# EasyEDA Pro project ASTROPET_DISPLAY_SOURCE.epro, board PCB4
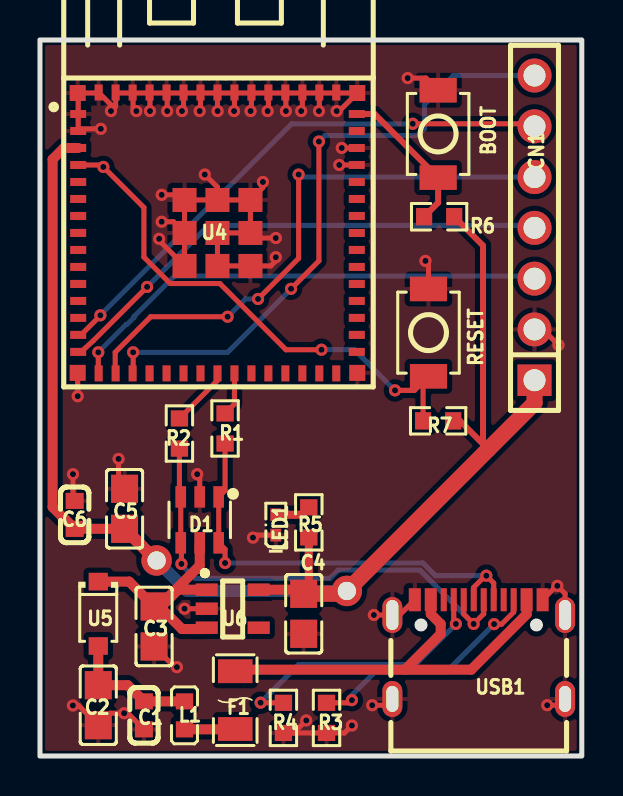
[diagram p4: board, top side]
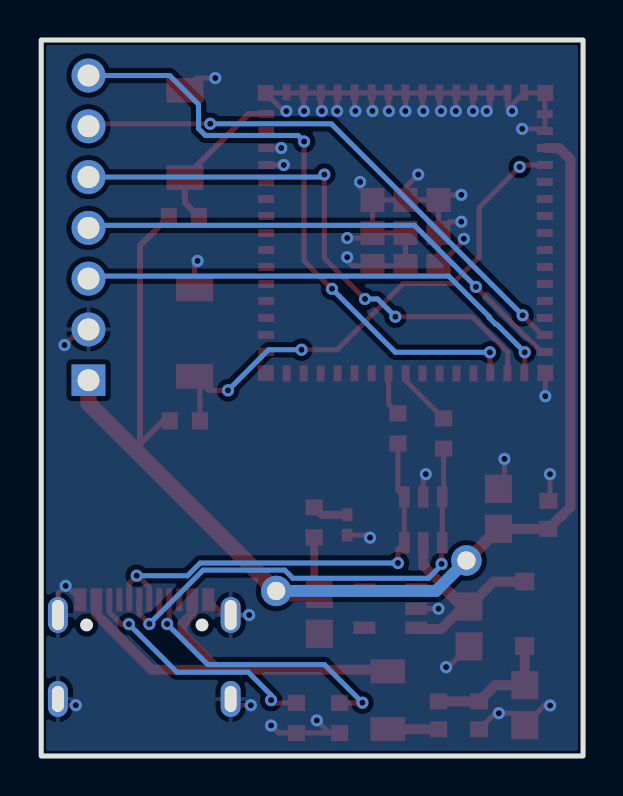
[diagram p5: board, bottom side, seen from below]

Outline 27.13 x 35.82 mm; copper layers: Top Layer, Bottom Layer. Coordinates in mm from the lower left corner of the outline.
Outline path: rectangle 0,35.82 27.13,0
Stack: Top Layer 0.035mm / Dielectric1 1.51mm FR4 er 4.5 / Bottom Layer 0.035mm

## Design rules (mm)
template: JLCPCB Capability(Two Layers Board)
spacing copperThickness1oz (default): track to track 0.102, other pairs 0.152 to 0.3
spacing copperThickness2oz: track to track 0.203, other pairs 0.152 to 0.3
track width copperThickness1oz (default): min 0.127, default 0.254, max 2.54
track width copperThickness2oz: min 0.203, default 0.254, max 2.54
differential pair differentialPair (default): width min 0.127, default 0.254, max 2.54; gap min 0.152, default 0.152
via viaSize (default): diameter min 0.5, default 0.61, max 10; hole min 0.3, default 0.305, max 6.3

## Placement (name value [footprint] x y rotation side)
BOOT  boot switch  [SW-SMD_L3.9-W3.0-P4.45]  19.94 31.12 90 top
C1  100nF  [C0603]  5.21 2.03 270 top
C2  47uF  [C0805]  2.92 2.54 270 top
C3  10uF  [C0805]  5.72 6.48 90 top
C4  22uF  [C0805]  13.21 7.11 90 top
C5  47uF  [C0805]  4.24 12.37 90 top
C6  100nF  [C0603]  1.74 12.06 90 top
CN1  screen  [HDR-TH_7P-P2.54-V-F]  24.76 26.42 90 top
D1  USBLC6-2SC6  [SOT-23-6_L2.9-W1.6-P0.95-LS2.8-BL]  8 11.81 180 top
F1  JK-NSMD075  [F1206]  9.78 2.8 270 top
L1  BLM18PG121SN1D  [L0603]  7.24 2.03 90 top
LED1  APHHS1005LSECK/J3-PF  [LED0402-RD_RED]  11.81 11.56 90 top
NOREF  -  [Pad_e86]  5.84 9.78 0 top
NOREF#2  -  [Pad_e78]  15.37 8.26 0 top
R1  22Ω  [R0603]  9.27 16.38 90 top
R2  22Ω  [R0603]  6.98 16.13 90 top
R3  5.1kΩ  [R0603]  14.35 1.91 270 top
R4  5.1kΩ  [R0603]  12.19 1.91 270 top
R5  10kΩ  [R0603]  13.46 11.69 90 top
R6  10kΩ  [R0603]  19.99 26.98 180 top
R7  10kΩ  [R0603]  19.94 16.77 180 top
RESET  reset switch  [SW-SMD_L3.9-W3.0-P4.45]  19.46 21.18 90 top
U4  2.4GHz  [BULETM-SMD_ESP32-S3-MINI-1-N8]  8.89 26.16 0 top
U5  MBR0520  [SOD-123_L2.7-W1.6-LS3.7-RD-A]  2.92 7.11 270 top
U6  AP2112K-3.3TRG1  [SOT-25-5_L2.9-W1.6-P0.95-LS2.8-BL]  9.65 7.37 270 top
USB1  TYPE C  [USB-C-SMD_TYPEC-304J-BCP16]  21.97 5.34 0 top

## Footprints (pads in the part's own frame, mm; a bottom-side part is the same pattern mirrored in y, then rotated)
BULETM-SMD_ESP32-S3-MINI-1-N8
  rect 0.8x0.4 smd: 1(-6.975,5.95) 2(-6.975,5.1) 3(-6.975,4.25) 4(-6.975,3.4) 5(-6.975,2.55) 6(-6.975,1.7) 7(-6.975,0.85) 8(-6.975,0) 9(-6.975,-0.85) 10(-6.975,-1.7) 11(-6.975,-2.55) 12(-6.975,-3.4) 13(-6.975,-4.25) 14(-6.975,-5.1) 15(-6.975,-5.95) 31(6.975,-5.95) 32(6.975,-5.1) 33(6.975,-4.25) 34(6.975,-3.4) 35(6.975,-2.55) 36(6.975,-1.7) 37(6.975,-0.85) 38(6.975,0) 39(6.975,0.85) 40(6.975,1.7) 41(6.975,2.55) 42(6.975,3.4) 43(6.975,4.25) 44(6.975,5.1) 45(6.975,5.95)
  rect 0.4x0.8 smd: 16(-5.95,-7.025) 17(-5.1,-7.025) 18(-4.25,-7.025) 19(-3.4,-7.025) 20(-2.55,-7.025) 21(-1.7,-7.025) 22(-0.85,-7.025) 23(0,-7.025) 24(0.85,-7.025) 25(1.7,-7.025) 26(2.55,-7.025) 27(3.4,-7.025) 28(4.25,-7.025) 29(5.1,-7.025) 30(5.95,-7.025) 46(5.95,7.025) 47(5.1,7.025) 48(4.25,7.025) 49(3.4,7.025) 50(2.55,7.025) 51(1.7,7.025) 52(0.85,7.025) 53(0,7.025) 54(-0.85,7.025) 55(-1.7,7.025) 56(-2.55,7.025) 57(-3.4,7.025) 58(-4.25,7.025) 59(-5.1,7.025) 60(-5.95,7.025)
  rect 0.8x0.8 smd: GND(-7,7) GND(-7,-7) GND(7,7) GND(7,-7)
  rect 1.2x1.2 smd: GND(-1.65,1.65) GND(-1.65,0) GND(-1.65,-1.65) GND(0,1.65) GND(0,0) GND(0,-1.65) GND(1.65,1.65) GND(1.65,0) GND(1.65,-1.65)
C0603
  rect 0.8x0.9 smd: 1(-0.7,0) 2(0.7,0)
C0805
  rect 1.41x1.35 smd: 1(-1,0) 2(1,0)
F1206
  rect 1.19x1.728 smd: 1(-1.445,0) 2(1.445,0)
HDR-TH_7P-P2.54-V-F
  rect 1.575x1.7 hole 1.1: 1(-7.62,0)
  round 1.7 hole 1.1: 2(-5.08,0) 3(-2.54,0) 4(0,0) 5(2.54,0) 6(5.08,0) 7(7.62,0)
L0603
  rect 0.8x0.864 smd: 1(-0.7,0) 2(0.7,0)
LED0402-RD_RED
  rect 0.636x0.54 smd: 1(-0.508,0) 2(0.508,0)
Pad_e78
  round 1.524 hole 0.914: 1(0,0)
Pad_e86
  round 1.524 hole 0.914: 1(0,0)
R0603
  rect 0.806x0.864 smd: 1(-0.753,0) 2(0.753,0)
SOD-123_L2.7-W1.6-LS3.7-RD-A
  rect 0.88x0.96 smd: 1(-1.61,0) 2(1.61,0)
SOT-23-6_L2.9-W1.6-P0.95-LS2.8-BL
  rect 0.532x1.072 smd: 1(-0.95,-1.149) 2(0,-1.149) 3(0.95,-1.149) 4(0.95,1.149) 5(0,1.149) 6(-0.95,1.149)
SOT-25-5_L2.9-W1.6-P0.95-LS2.8-BL
  rect 0.623x1.105 smd: 1(-0.95,-1.3) 2(-0.001,-1.3) 3(0.95,-1.3) 4(0.95,1.3) 5(-0.95,1.3)
SW-SMD_L3.9-W3.0-P4.45
  rect 1.23x1.86 smd: 1(-2.185,0) 2(2.185,0)
USB-C-SMD_TYPEC-304J-BCP16
  oval 1x1.8 hole 0.6x1.5: 13(-4.325,1.718) 14(4.325,1.718)
  oval 1x1.8 hole 0.6x1.3: 15(-4.325,-2.482) 16(4.325,-2.482)
  rect 0.6x1.15 smd: A1B12(-3.2,2.482) A4B9(-2.4,2.482) B1A12(3.2,2.482) B4A9(2.4,2.482)
  rect 0.3x1.15 smd: A5(-1.25,2.482) A6(-0.25,2.482) A7(0.25,2.482) A8(1.25,2.482) B5(1.75,2.482) B6(0.75,2.482) B7(-0.75,2.482) B8(-1.75,2.482)

## Nets
As in the schematic, except:
3V3: C4.2 C5.1 C6.1 CN1.1 NOREF.1 NOREF#2.1 R5.1 R6.1 R7.1 U4.3 U6.5

Pads without a net: U4 5 6 7 8 9 10 11 12 13 19 20 21 22 25 26 27 28 29 30 31 32 33 34 35 36 37 38 39 40 41 44; U6 4; USB1 A8 B8

## Via types
v1: diameter 0.61, hole 0.305, Top Layer to Bottom Layer, 63 vias

## Routing (per net, layer and track width the routed paths; a pad name or vN(x,y) marks a point on that pad's centre or on a via; arc(x,y) is an arc through that point)
3V3: length 71.3
  Top Layer w0.3: 22.19,15.61 22.45,15.34 ; 22.19,15.61 21.03,16.77 R7.1 ; 22.19,15.61 22.19,25.53 R6.1
  Top Layer w0.4: R5.1 13.46,8.51 13.59,8.38
  Top Layer w0.5: C5.1 1.74,11.37 ; 1.74,11.37 C6.1 ; 1.74,11.37 1.15,11.96 1.12,11.96 0.63,12.45 0.63,29.85 1.2,30.41 U4.3 ; C4.2 13,8.32 U6.5
  Top Layer w0.6: NOREF.1 5.82,9.78 C5.1
  Top Layer w0.8: C4.2 15.22,8.11 NOREF#2.1 24.76,17.65 CN1.1
  Bottom Layer w0.6: NOREF#2.1 7.37,8.26 NOREF.1
5V: length 13.2
  Top Layer w0.5: U6.1 6.92,8.32 6.08,7.48 5.98,7.48 7.11,6.35 8.29,6.35 U6.3 ; U5.1 4.47,8.72 C3.2 5.95,7.48 8,9.53 D1.5
GND: length 86.4
  Top Layer w0.254: U4.GND 11.16,28.44 v1(11.16,28.71) ; U4.GND U4.GND ; U4.GND U4.GND ; C3.1 6.75,4.45 v1(6.86,4.45) ; 13.14,33.16 12.31,33.16 U4.49 ; 13.14,33.16 13.99,33.16 ; 13.14,33.16 U4.48 ; 13.14,33.16 13.14,32.32 v1(13.08,32.26) ; U4.52 9.74,33.16 ; 9.74,33.16 9.74,32.28 v1(9.72,32.26) ; 9.74,33.16 10.59,33.16 ; 9.74,33.16 8.89,33.16 ; v1(11.4,32.26) 11.44,32.3 11.44,33.16 ; v1(8.25,29.08) 8.89,28.45 U4.GND ; v1(8,32.26) 8.04,32.3 8.04,33.16 ; v1(7.11,32.26) 7.19,32.34 7.19,33.16 6.35,33.16 ; v1(11.81,25.91) 10.79,25.91 U4.GND ; v1(4.83,32.26) 4.66,32.42 4.66,33.16 ; U4.53 8.89,33.16 ; 8.89,33.16 8.89,32.27 v1(8.9,32.26) ; 8.89,33.16 8.04,33.16 ; v1(18.41,33.91) 19.33,33.91 BOOT.2 ; USB1.16 25.98,2.54 v1(25.4,2.54) ; 6.35,33.16 6.37,33.14 v1(6.37,32.26) ; 6.35,33.16 6.35,33.18 U4.56 ; 6.35,33.16 5.51,33.16 ; USB1.15 17.33,2.54 v1(16.64,2.54) ; LED1.1 10.79,11.05 v1(10.67,10.92) ; v1(5.51,32.26) 5.51,33.16 5.51,33.16 ; U4.GND U4.GND U4.GND U4.GND 11.56,24.51 11.81,24.77 v1(11.81,24.95) ; U4.51 10.59,33.16 ; 10.59,33.16 11.44,33.16 ; 10.59,33.16 10.59,32.3 v1(10.55,32.26) ; U4.GND U4.GND ; U4.GND 6.98,28.07 v1(6.1,28.07) ; U4.GND U4.GND ; 13.99,33.16 U4.47 ; 13.99,33.16 13.99,32.28 v1(13.97,32.26) ; 13.99,33.16 14.84,33.16 ; v1(7.87,14.1) 8,13.97 D1.2 ; C5.2 3.94,13.67 v1(3.94,14.86) ; v1(5.97,25.87) 5.97,25.78 U4.GND U4.GND ; 8.04,33.16 7.22,33.16 U4.55 ; 8.04,33.16 U4.54 ; 5.51,33.16 4.66,33.16 ; 5.51,33.16 U4.57 ; USB1.A1B12 18.01,7.05 USB1.13 v1(16.72,7.05) ; R4.2 12.71,1.15 ; 12.71,1.15 v1(13.33,1.78) ; 12.71,1.15 R3.2 15.25,1.15 v1(15.62,1.53) ; 14.86,33.16 14.89,33.14 ; 14.86,33.16 U4.GND 14.99,32.26 v1(14.86,32.26) ; 14.86,33.16 U4.46 ; 11.44,33.16 U4.50 ; 11.44,33.16 12.29,33.16 ; U6.2 v1(7.24,7.37) ; U4.GND 6.68,26.72 v1(6.1,26.72) ; U4.60 2.97,33.16 ; 2.97,33.16 U4.GND 1.91,33.14 U4.1 1.91,31.26 2.02,31.37 v1(3.05,31.37) ; 2.97,33.16 3.56,32.57 v1(3.56,32.26) 3.79,32.49 3.79,33.16 ; USB1.B1A12 25.86,8.51 v1(25.91,8.51) 26.3,8.12 USB1.14 ; U4.GND v1(1.89,18) ; U4.42 v1(14.99,29.56) ; CN1.2 25.18,21.34 v1(25.97,20.56) ; 4.66,33.16 U4.58 ; 4.66,33.16 3.79,33.16 ; C1.2 4.4,2.14 v1(4.22,2.14) 3.52,2.14 C2.2 1.93,2.53 v1(1.65,2.53) ; v1(19.3,24.77) 19.46,24.61 RESET.2 ; v1(1.65,14.1) 1.65,12.85 C6.2 ; U4.59 3.79,33.16 ; 12.32,33.16 v1(12.32,32.26) ; U4.43 v1(15.11,30.41)
VBUS: length 20.9
  Top Layer w0.5: 18.28,4.32 20.07,6.11 20.07,6.61 19.57,7.1 USB1.A4B9 ; 18.28,4.32 9.86,4.32 F1.1 ; 18.28,4.32 21.6,4.32 24.37,7.09 USB1.B4A9
BOOT: length 7.6
  Top Layer w0.3: U4.45 16.76,32.11 BOOT.1 19.94,27.68 R6.2
CS: length 27.3
  Top Layer w0.254: v1(18.67,31.62) 24.64,31.62 CN1.6 ; U4.14 2.06,21.06 3.03,22.04 v1(3.03,22.04)
  Bottom Layer w0.254: v1(18.67,31.62) 12.61,31.62 v1(3.03,22.04)
D+: length 2.2
  Top Layer w0.254: U4.24 9.74,17.61 R1.2
D-: length 3
  Top Layer w0.254: U4.23 8.89,18.79 R2.2
DC: length 28.3
  Top Layer w0.254: v1(10.92,22.86) 12.95,24.89 v1(12.95,29.08) ; v1(9.4,21.97) 5.55,21.97 3.77,20.19 3.77,19.16 U4.17
  Bottom Layer w0.254: v1(12.95,29.08) 13.08,28.96 CN1.5 ; v1(10.92,22.86) 10.29,22.86 v1(9.4,21.97)
DN: length 24.9
  Top Layer w0.254: USB1.B7 21.22,7.1 v1(21.72,6.61) 22.22,7.11 USB1.A7 ; R2.1 6.98,13.03 D1.3 D1.4 7.08,10.63 v1(7.08,9.61)
  Bottom Layer w0.254: v1(7.08,9.61) 7.08,9.55 7.75,8.89 14.53,8.89 14.94,9.3 19.02,9.3 v1(21.72,6.61)
DP: length 22.4
  Top Layer w0.254: USB1.A6 21.72,8.44 22.3,9.02 v1(22.35,9.02) 22.72,8.65 USB1.B6 ; R1.1 9.27,13.28 D1.1 D1.6 9.27,10.34 v1(9.27,9.65)
  Bottom Layer w0.254: v1(22.35,9.02) 19.81,9.02 19.17,9.65 v1(9.27,9.65)
RESET: length 25.9
  Top Layer w0.254: v1(17.78,18.29) 18.75,18.29 19.19,18.72 ; 19.19,18.72 RESET.1 ; 19.19,18.72 R7.2 ; v1(14.1,20.32) 12.32,20.32 9.01,23.63 6.52,23.63 5.21,24.95 5.21,27.43 v1(3.17,29.47) 3.08,29.56 U4.4
  Bottom Layer w0.254: v1(17.78,18.29) 15.75,20.32 v1(14.1,20.32)
RST: length 31.1
  Top Layer w0.254: v1(4.67,20.19) 4.67,19.17 U4.18 ; v1(13.97,30.74) 13.97,24.77 v1(12.57,23.37)
  Bottom Layer w0.254: v1(12.57,23.37) 9.4,20.19 v1(4.67,20.19) ; CN1.7 20.7,34.04 19.25,32.59 19.25,31.38 18.91,31.04 14.27,31.04 v1(13.97,30.74)
SCL: length 24.6
  Top Layer w0.254: U4.16 2.92,19.16 v1(2.92,20.19)
  Bottom Layer w0.254: v1(2.92,20.19) 4.31,21.59 4.36,21.59 4.7,21.93 4.7,21.98 6.73,24 24.64,24 CN1.3
SDA: length 25.5
  Top Layer w0.254: U4.15 2.06,20.21 2.68,20.78 v1(5.37,23.47)
  Bottom Layer w0.254: CN1.4 24.64,26.54 8.44,26.54 v1(5.37,23.47)
$1N603: length 12
  Top Layer w0.254: R3.1 15.49,2.66 v1(15.62,2.8) ; USB1.B5 23.72,7.2 23.12,6.6 v1(22.74,6.6)
  Bottom Layer w0.254: v1(22.74,6.6) 20.34,4.19 16.76,4.19 15.62,3.05 v1(15.62,2.8)
$1N746: length 13.8
  Top Layer w0.254: R4.1 11.06,2.66 v1(11.05,2.67) ; v1(20.83,6.61) 20.72,6.71 USB1.A5
  Bottom Layer w0.254: v1(20.83,6.61) 18.8,4.57 12.95,4.57 v1(11.05,2.67)
$1N1092: length 2.5
  Top Layer w0.5: L1.1 9.76,1.33 F1.2
$1N1098: length 6.6
  Top Layer w0.5: U5.2 C2.1 4.4,3.54 C1.1 L1.2
$1N1982: length 1.8
  Top Layer w0.4: R5.2 13.09,12.07 LED1.2

## Copper pours and planes (outline as drawn; the poured copper is in the pictures)
GND on Top Layer: -0.51,36.2 27.13,36.2 27.13,0 -0.51,0
GND on Bottom Layer: -0.49,35.82 27.13,35.82 27.13,0.21 -0.49,0.21
